# Altium schematic sheet sensor.SchDoc
size A; SheetNumber: 3; SheetTotal: 6
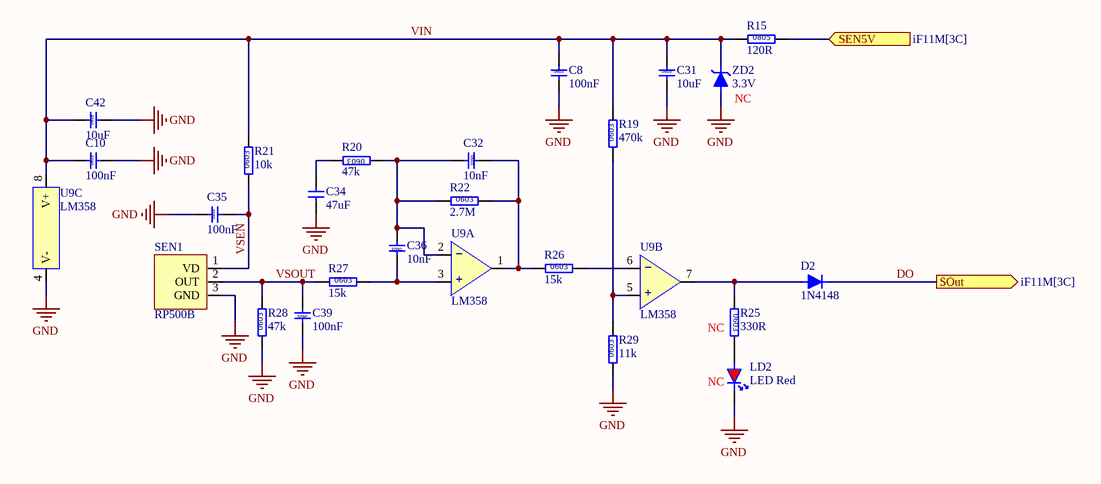
[diagram p0: sensor.SchDoc]

## Parts
C8  100nF  [C0603]
C10  100nF  [C0603]
C31  10uF  [C0805]
C32  10nF  [C0603]
C34  47uF  [C0603]
C35  100nF  [C0805]
C36  10nF  [C0603]
C39  100nF  [C0805]
C42  10uF  [C0805]
D2  1N4148  [SOD-323]
LD2  LED Red  [LED-0603-RED]
R15  120R  [R0805-LD]
R19  470k  [R0603-LD]
R20  47k  [R0603-LD]
R21  10k  [R0603-LD]
R22  2.7M  [R0603-LD]
R25  330R  [R0603-LD]
R26  15k  [R0603-LD]
R27  15k  [R0603-LD]
R28  47k  [R0603-LD]
R29  11k  [R0603-LD]
SEN1  RP500B  [TO-5-Lbent]
U9  LM358  [LM358-SOIC8]  (parts A,B,C of 3)
ZD2  3.3V  [SOD-323]

## Ports
SEN5V (in, see iF11M[3C]), SOut (out, see iF11M[3C])

## Nets
GND: C8.2 C10.2 C31.2 C34.2 C35.1 C39.1 C42.2 LD2.2(K) R28.1 R29.1 SEN1.3(GND) U9.4(V-) ZD2.1(A)
DO: D2.2(K) ; port SOut
SEN5V: R15.2 ; port SEN5V
VIN: C8.1 C10.1 C31.1 C42.1 R15.1 R19.2 R21.2 U9.8(V+) ZD2.2(K)
VSEN: C35.2 R21.1 SEN1.1(VD)
VSOUT: C39.2 R27.1 R28.2 SEN1.2(OUT)
NetC32_1: C32.1 R22.2 R26.1 U9.1(O1)
NetC32_2: C32.2 C36.2 R20.1 R22.1 U9.2(-)
NetC34_1: C34.1 R20.2
NetC36_1: C36.1 R27.2 U9.3(+)
NetD2_1: D2.1(A) R25.1 U9.7(O2)
NetLD2_1: LD2.1(A) R25.2
NetR19_1: R19.1 R29.2 U9.5(+)
NetR26_2: R26.2 U9.6(-)

## Notes on the sheet
- (near ZD2) NC
- (near R25) NC
- (near LD2) NC
- (in symbol C 0603 10nF 50V) 0603
- (in symbol C 0603 100nF 50V) 0603
- (in symbol C 0805 10uF 25V) 0805
- (in symbol C 0805 100nF 50V) 0805
- (in symbol LM358, part A) −
- (in symbol LM358, part B) −
- (in symbol R 0603 10k) 0603
- (in symbol R 0603 15k) 0603
- (in symbol R 0603 47k) 0603
- (in symbol R 0603 330R) 0603
- (in symbol R 0805 120R) 0805

## Library data of the parts
C8 C10 = C 0603 100nF 50V: 10% 50V; Part No: W-T-CA-X703N100K50VNT; Manufacturer: FENGHUA; Material Name: 贴片电容0603 100NF/50V 10%; Product Code: WP0002721; Supplier: 南京南山半导体有限公司
C31 C42 = C 0805 10uF 25V: 10% 25V; Part No: WP0005368; Material Name: 贴片电容0805 10UF/25V 10%; Product Code: WP0005368; Supplier: 深圳市四叶电子有限公司; Manufacturer: *
C32 C36 = C 0603 10nF 50V: 10% 50V; Part No: W-T-CA-X703N10K50VNT; Material Name: 贴片电容0603 10NF/50V 10%; Product Code: WP0003409; Supplier: 南京南山半导体有限公司; Manufacturer: *
C34 = Capacitor: SMD resistor  Package; Part No: *; Product Code: *; Suppliers: 南京南山半导体有限公司; Manufacturer: *
C35 C39 = C 0805 100nF 50V: 10% 50V; Part No: W-T-CA-X705N100K50VNT; Material Name: 贴片电容0805 100NF/50V 10%; Product Code: WP0002825; Supplier: "深圳市硕洋电子科技有限公司; Manufacturer: *
D2 = IN4148: Part No: W-T-DE-1N4148-SOD123; Material Name: 开关二极管/4148-SOD123; Product Code: WP0002828; Supplier: 上海吉锝芯微电子有限公司
R15 = R 0805 120R: 5%; Part No: W-T-RE-RS05K121JT; Material Name: 贴片电阻0805 120Ω 5%; Product Code: WP0003450; Supplier: 南京南山半导体有限公司; Manufacturer: *
R19 R26 R27 = R 0603 15k: 5%; Part No: W-T-RE-RS03K153JT; Manufacturer: 改善传感器，2023/01/08新增; Material Name: 贴片电阻0603 15K 5%; Product Code: WP0002709; Supplier: 南京南山半导体有限公司
R20 R22 R28 = R 0603 47k: 5%; Part No: W-T-RE-RS03K473JT; Material Name: 贴片电阻0603 47K 5%; Product Code: WP0003793; Supplier: 南京南山半导体有限公司
R21 R29 = R 0603 10k: 5%; Part No: W-T-RE-RS03K103JT; Manufacturer: 热敏D541V11增加1颗用量; Material Name: 贴片电阻0603 10K 5%; Product Code: WP0002708; Supplier: 南京南山半导体有限公司
R25 = R 0603 330R: 5%; Part No: W-T-RE-RS03K331JT; Material Name: 贴片电阻0603 330Ω 5%; Product Code: WP0003776; Supplier: 南京南山半导体有限公司
U9 = LM358: DUAL OPAMP
ZD2 = Zener Diode: Zener Diode 300mW
LD2 = LED Red: Part No: *; Product Code: *; Suppliers: *; Manufacturer: *